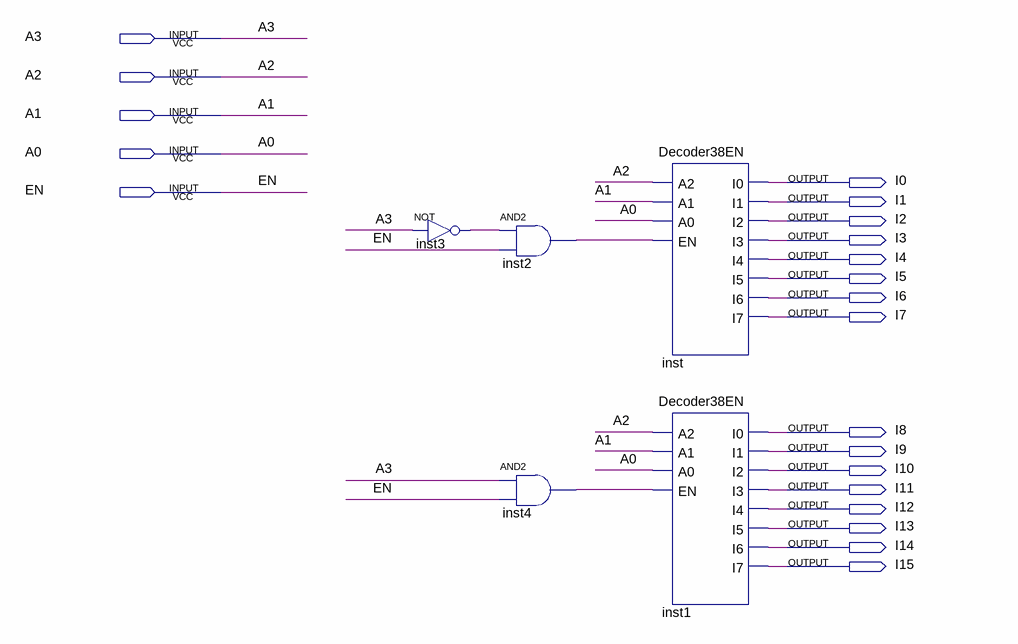
[diagram p0: schematic sheet]
// Quartus schematic Decoder416EN.bdf as structural Verilog: 5 symbols, 21 pins
module Decoder416EN (
  input  A3,
  input  A2,
  input  A1,
  input  A0,
  input  EN,
  output I0,
  output I1,
  output I2,
  output I3,
  output I4,
  output I5,
  output I6,
  output I7,
  output I8,
  output I9,
  output I10,
  output I11,
  output I12,
  output I13,
  output I14,
  output I15
);

  wire inst2_out, inst3_out, inst4_out;

  not inst3 (inst3_out, A3);
  and inst2 (inst2_out, inst3_out, EN);
  and inst4 (inst4_out, A3, EN);
  Decoder38EN inst (
    .A2(A2), .A1(A1), .A0(A0), .EN(inst2_out), .I0(I0), .I1(I1), .I2(I2), .I3(I3), .I4(I4), .I5(I5), .I6(I6),
    .I7(I7));
  Decoder38EN inst1 (
    .A2(A2), .A1(A1), .A0(A0), .EN(inst4_out), .I0(I8), .I1(I9), .I2(I10), .I3(I11), .I4(I12), .I5(I13),
    .I6(I14), .I7(I15));
endmodule
